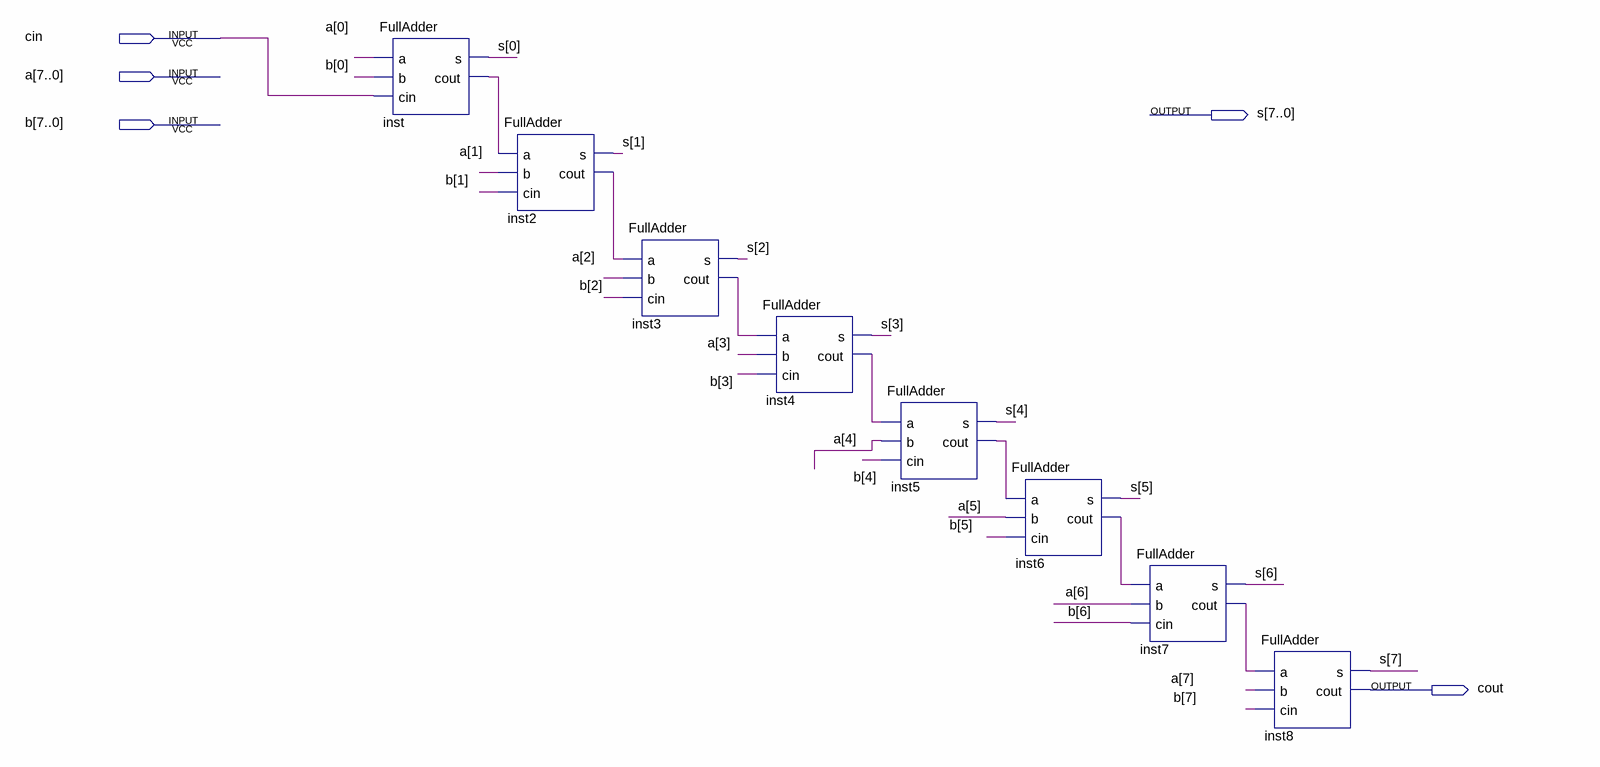
[diagram p0: schematic sheet]
// Quartus schematic 8BAdder.bdf as structural Verilog: 8 symbols, 5 pins
module \8BAdder  (
  input  cin,
  input  [7:0] a,
  input  [7:0] b,
  output [7:0] s,
  output cout
);

  wire inst2_cout, inst3_cout, inst4_cout, inst5_cout, inst6_cout, inst7_cout, inst_cout;

  FullAdder inst (.a(a[0]), .b(b[0]), .cin(cin), .s(s[0]), .cout(inst_cout));
  FullAdder inst2 (.a(inst_cout), .b(a[1]), .cin(b[1]), .s(s[1]), .cout(inst2_cout));
  FullAdder inst3 (.a(inst2_cout), .b(a[2]), .cin(b[2]), .s(s[2]), .cout(inst3_cout));
  FullAdder inst4 (.a(inst3_cout), .b(a[3]), .cin(b[3]), .s(s[3]), .cout(inst4_cout));
  FullAdder inst5 (.a(inst4_cout), .b(a[4]), .cin(b[4]), .s(s[4]), .cout(inst5_cout));
  FullAdder inst6 (.a(inst5_cout), .b(a[5]), .cin(b[5]), .s(s[5]), .cout(inst6_cout));
  FullAdder inst7 (.a(inst6_cout), .b(a[6]), .cin(b[6]), .s(s[6]), .cout(inst7_cout));
  FullAdder inst8 (.a(inst7_cout), .b(a[7]), .cin(b[7]), .s(s[7]), .cout(cout));
endmodule
